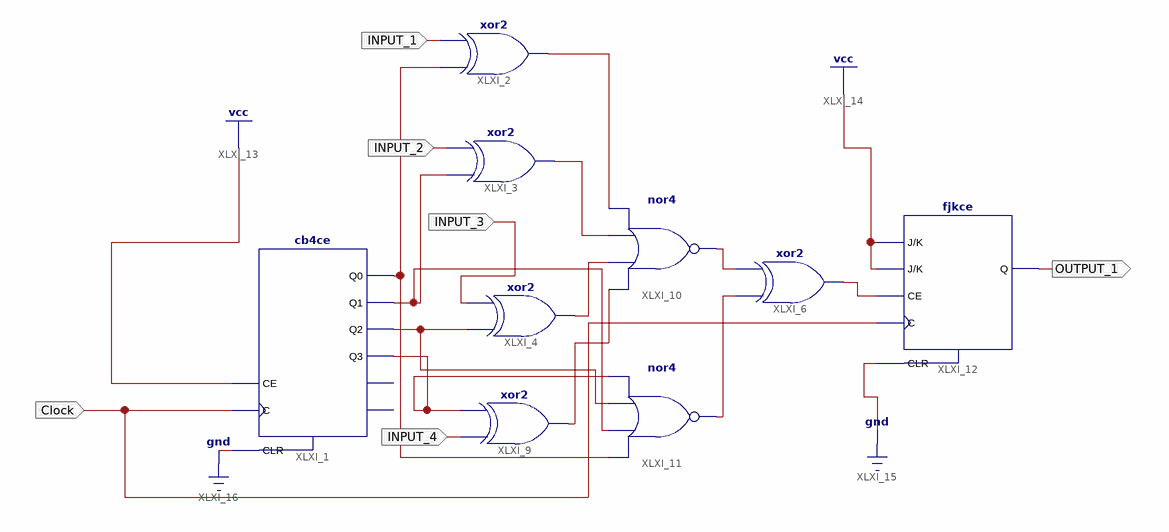
[diagram p0: schematic sheet 1]
// Xilinx ISE schematic Schematic.sch (spartan6) as structural Verilog: 9 symbols, 6 ports
module Schematic (
  input  INPUT_1,
  input  INPUT_2,
  input  INPUT_3,
  input  INPUT_4,
  input  Clock,
  output OUTPUT_1
);

  wire XLXN_1, XLXN_2, XLXN_15, XLXN_18, XLXN_22, XLXN_23, XLXN_24, XLXN_25, XLXN_26, XLXN_27, XLXN_31;

  cb4ce XLXI_1 (
    .C(Clock), .CE(1'b1), .CLR(1'b0), .Q0(XLXN_1), .Q1(XLXN_2), .Q2(XLXN_18), .Q3(XLXN_15));  // open: CEO, TC
  xor XLXI_2 (XLXN_22, XLXN_1, INPUT_1);
  xor XLXI_3 (XLXN_23, XLXN_2, INPUT_2);
  xor XLXI_4 (XLXN_24, XLXN_18, INPUT_3);
  xor XLXI_6 (XLXN_31, XLXN_27, XLXN_26);
  xor XLXI_9 (XLXN_25, INPUT_4, XLXN_15);
  nor XLXI_10 (XLXN_26, XLXN_25, XLXN_24, XLXN_23, XLXN_22);
  nor XLXI_11 (XLXN_27, XLXN_1, XLXN_2, XLXN_18, XLXN_15);
  fjkce XLXI_12 (.C(Clock), .CE(XLXN_31), .CLR(1'b0), .J(1'b1), .K(1'b1), .Q(OUTPUT_1));
endmodule
